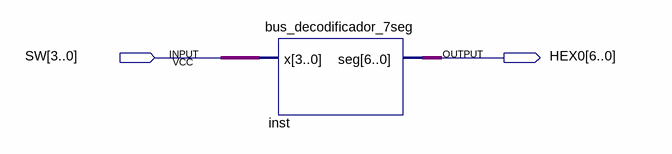
[diagram p0: schematic sheet]
// Quartus schematic bus_decodificador_7seg_Teste.bdf as structural Verilog: 1 symbols, 2 pins
module bus_decodificador_7seg_Teste (
  input  [3:0] SW,
  output [6:0] HEX0
);

  bus_decodificador_7seg inst (.x(SW), .seg(HEX0));
endmodule
